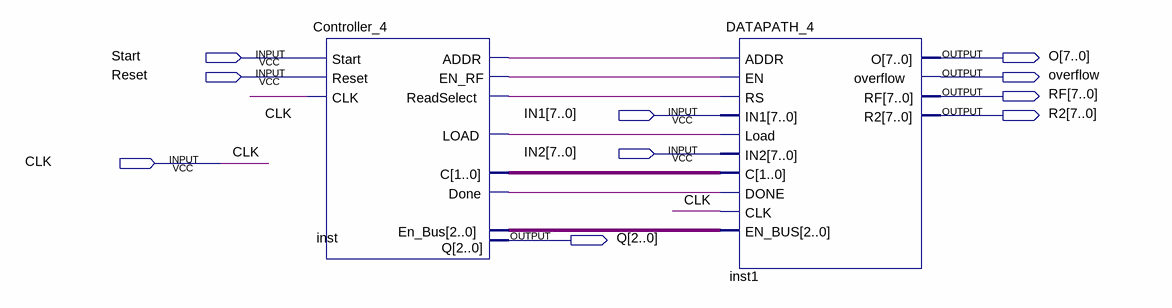
[diagram p0: schematic sheet]
// Quartus schematic Bai4.bdf as structural Verilog: 2 symbols, 10 pins
module Bai4 (
  input  Start,
  input  Reset,
  input  [7:0] IN1,
  input  [7:0] IN2,
  input  CLK,
  output [7:0] O,
  output overflow,
  output [7:0] RF,
  output [7:0] R2,
  output [2:0] Q
);

  wire inst_addr, inst_done, inst_en_rf, inst_load, inst_readselect;
  wire [1:0] inst_c;
  wire [2:0] inst_en_bus;

  Controller_4 inst (
    .Start(Start), .Reset(Reset), .CLK(CLK), .Q(Q), .C(inst_c), .LOAD(inst_load), .En_Bus(inst_en_bus),
    .ADDR(inst_addr), .ReadSelect(inst_readselect), .Done(inst_done), .EN_RF(inst_en_rf));
  DATAPATH_4 inst1 (
    .ADDR(inst_addr), .EN(inst_en_rf), .RS(inst_readselect), .IN1(IN1), .Load(inst_load), .IN2(IN2),
    .C(inst_c), .DONE(inst_done), .CLK(CLK), .EN_BUS(inst_en_bus), .O(O), .overflow(overflow), .RF(RF),
    .R2(R2));
endmodule
